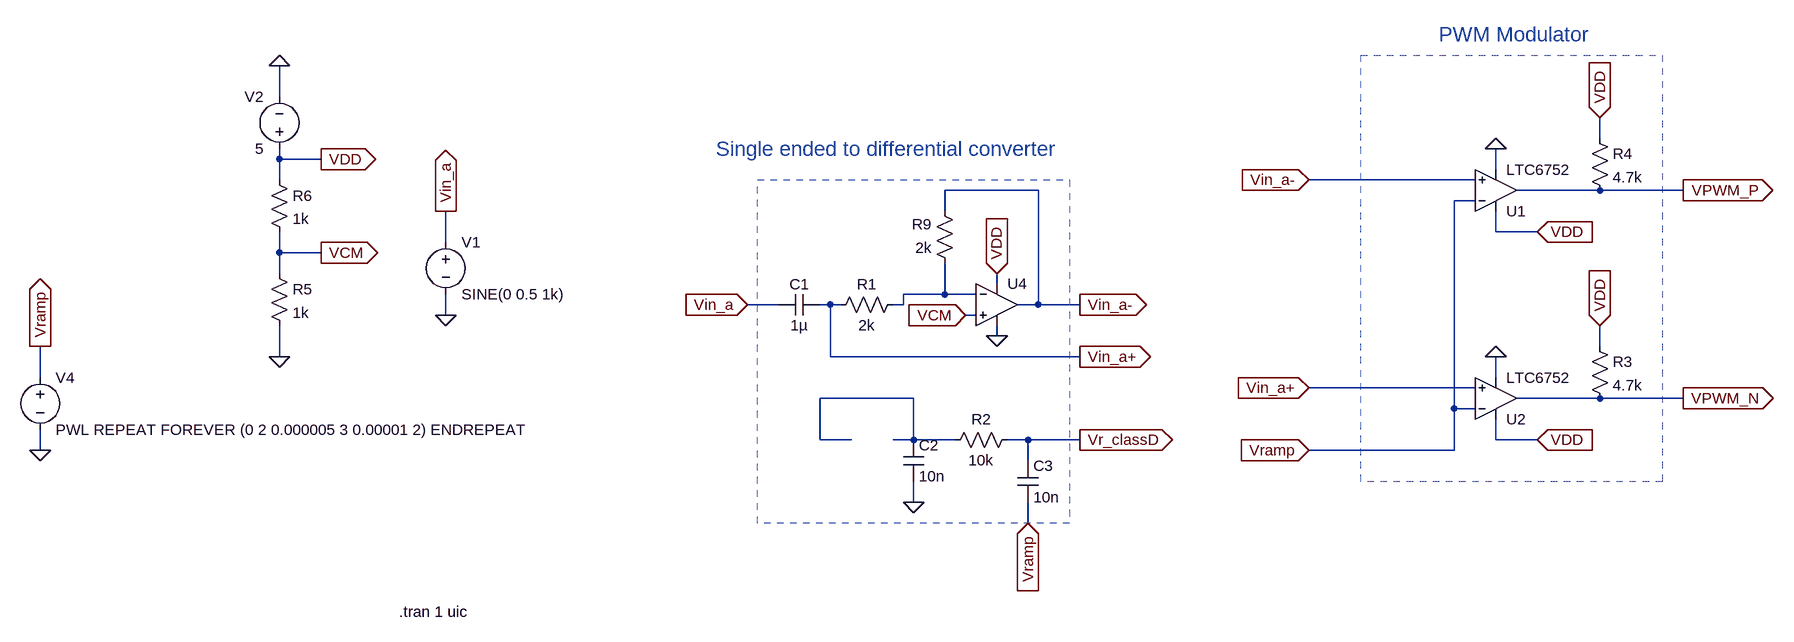
[diagram p0: schematic prelab4.asc]
prelab4.asc, the LTspice schematic file:
Version 4
SHEET 1 1448 1076
WIRE -880 -112 -880 -160
WIRE 1152 -48 1152 -80
WIRE -880 -16 -880 -32
WIRE -816 -16 -880 -16
WIRE 992 0 992 -32
WIRE -880 16 -880 -16
WIRE 960 16 704 16
WIRE 288 32 144 32
WIRE 1152 32 1024 32
WIRE 1280 32 1152 32
WIRE 960 48 928 48
WIRE 144 64 144 32
WIRE 992 96 992 64
WIRE 1056 96 992 96
WIRE -624 112 -624 64
WIRE -880 128 -880 96
WIRE -816 128 -880 128
WIRE -880 160 -880 128
WIRE 224 176 224 160
WIRE 144 192 144 144
WIRE 144 192 80 192
WIRE 192 192 144 192
WIRE -112 208 -160 208
WIRE -32 208 -48 208
WIRE -16 208 -32 208
WIRE 80 208 80 192
WIRE 80 208 64 208
WIRE 288 208 288 32
WIRE 288 208 256 208
WIRE 352 208 288 208
WIRE -624 224 -624 192
WIRE 192 224 176 224
WIRE 224 256 224 240
WIRE 1152 272 1152 240
WIRE -880 288 -880 240
WIRE -32 288 -32 208
WIRE 352 288 -32 288
WIRE -1248 320 -1248 272
WIRE 992 320 992 288
WIRE 960 336 704 336
WIRE 96 352 -48 352
WIRE 1152 352 1024 352
WIRE 1280 352 1152 352
WIRE 928 368 928 48
WIRE 960 368 928 368
WIRE -48 416 -48 352
WIRE 0 416 -48 416
WIRE 96 416 96 352
WIRE 96 416 64 416
WIRE 160 416 96 416
WIRE 272 416 240 416
WIRE 352 416 272 416
WIRE 992 416 992 384
WIRE 1056 416 992 416
WIRE -1248 432 -1248 400
WIRE 928 432 928 368
WIRE 928 432 704 432
WIRE 272 448 272 416
WIRE 96 512 96 480
WIRE 272 544 272 512
FLAG 352 208 Vin_a-
IOPIN 352 208 Out
FLAG 352 416 Vr_classD
IOPIN 352 416 Out
FLAG -160 208 Vin_a
IOPIN -160 208 In
FLAG 272 544 Vramp
IOPIN 272 544 In
FLAG -624 224 0
FLAG -624 64 Vin_a
IOPIN -624 64 Out
FLAG 1056 96 VDD
IOPIN 1056 96 In
FLAG 1056 416 VDD
IOPIN 1056 416 In
FLAG 992 288 0
FLAG 992 -32 0
FLAG 1152 -80 VDD
IOPIN 1152 -80 In
FLAG 1152 240 VDD
IOPIN 1152 240 In
FLAG 704 16 Vin_a-
IOPIN 704 16 In
FLAG 704 336 Vin_a+
IOPIN 704 336 In
FLAG 704 432 Vramp
IOPIN 704 432 In
FLAG 1280 32 VPWM_P
IOPIN 1280 32 Out
FLAG 1280 352 VPWM_N
IOPIN 1280 352 Out
FLAG -880 288 0
FLAG -880 -160 0
FLAG -816 -16 VDD
IOPIN -816 -16 Out
FLAG -816 128 VCM
IOPIN -816 128 Out
FLAG 224 160 VDD
IOPIN 224 160 In
FLAG 224 256 0
FLAG 176 224 VCM
IOPIN 176 224 In
FLAG -1248 272 Vramp
IOPIN -1248 272 Out
FLAG -1248 432 0
FLAG 96 512 0
FLAG 352 288 Vin_a+
IOPIN 352 288 Out
SYMBOL res 256 400 R90
WINDOW 0 0 56 VBottom 2
WINDOW 3 32 56 VTop 2
SYMATTR InstName R2
SYMATTR Value 10k
SYMBOL cap 256 448 R0
SYMATTR InstName C3
SYMATTR Value 10n
SYMBOL cap 80 416 R0
SYMATTR InstName C2
SYMATTR Value 10n
SYMBOL voltage -624 96 R0
WINDOW 123 0 0 Left 0
WINDOW 39 0 0 Left 0
SYMATTR InstName V1
SYMATTR Value SINE(0 0.5 1k)
SYMBOL Comparators\\LTC6752 992 96 M180
SYMATTR InstName U1
SYMBOL Comparators\\LTC6752 992 416 M180
SYMATTR InstName U2
SYMBOL res 1136 256 R0
SYMATTR InstName R3
SYMATTR Value 4.7k
SYMBOL res 1136 -64 R0
SYMATTR InstName R4
SYMATTR Value 4.7k
SYMBOL res -896 144 R0
SYMATTR InstName R5
SYMATTR Value 1k
SYMBOL res -896 0 R0
SYMATTR InstName R6
SYMATTR Value 1k
SYMBOL voltage -880 -16 R180
WINDOW 0 24 96 Left 2
WINDOW 3 24 16 Left 2
WINDOW 123 0 0 Left 0
WINDOW 39 0 0 Left 0
SYMATTR InstName V2
SYMATTR Value 5
SYMBOL res 80 192 R90
WINDOW 0 0 56 VBottom 2
WINDOW 3 32 56 VTop 2
SYMATTR InstName R1
SYMATTR Value 2k
SYMBOL res 160 160 R180
WINDOW 0 36 76 Left 2
WINDOW 3 36 40 Left 2
SYMATTR InstName R9
SYMATTR Value 2k
SYMBOL cap -48 192 R90
WINDOW 0 0 32 VBottom 2
WINDOW 3 32 32 VTop 2
SYMATTR InstName C1
SYMATTR Value 1µ
SYMBOL OpAmps\\UniversalOpAmp1 224 208 R0
SYMATTR InstName U4
SYMBOL voltage -1248 304 R0
SYMATTR InstName V4
SYMATTR Value PWL REPEAT FOREVER (0 2 0.000005 3 0.00001 2) ENDREPEAT
TEXT -696 680 Left 2 !.tran 1 uic
TEXT -208 -32 Left 3 ;Single ended to differential converter
TEXT 904 -208 Left 3 ;PWM Modulator
RECTANGLE Normal 1248 480 784 -176 2
RECTANGLE Normal 336 544 -144 16 2

The netlist it stands for:
* prelab4.asc
R2 Vr_classD N002 10k
C3 Vr_classD Vramp 10n
C2 N002 0 10n
V1 Vin_a 0 SINE(0 0.5 1k)
XU1 Vin_a- Vramp VDD 0 VPWM_P LTC6752  ; pins In+ In- V+ V- OUT
XU2 Vin_a+ Vramp VDD 0 VPWM_N LTC6752  ; pins In+ In- V+ V- OUT
R3 VDD VPWM_N 4.7k
R4 VDD VPWM_P 4.7k
R5 VCM 0 1k
R6 VDD VCM 1k
V2 VDD 0 5
R1 N001 Vin_a+ 2k
R9 N001 Vin_a- 2k
C1 Vin_a+ Vin_a 1µ
XU4 VCM N001 VDD 0 Vin_a- level1 Avol=1Meg GBW=10Meg Vos=0 En=0 Enk=0 In=0 Ink=0 Rin=500Meg  ; pins In+ In- V+ V- OUT
V4 Vramp 0 PWL REPEAT FOREVER (0 2 0.000005 3 0.00001 2) ENDREPEAT
.tran 1 uic
* Single ended to differential converter
* PWM Modulator
.lib LTC7.lib
.lib UniversalOpAmp1.lib
.backanno
.end